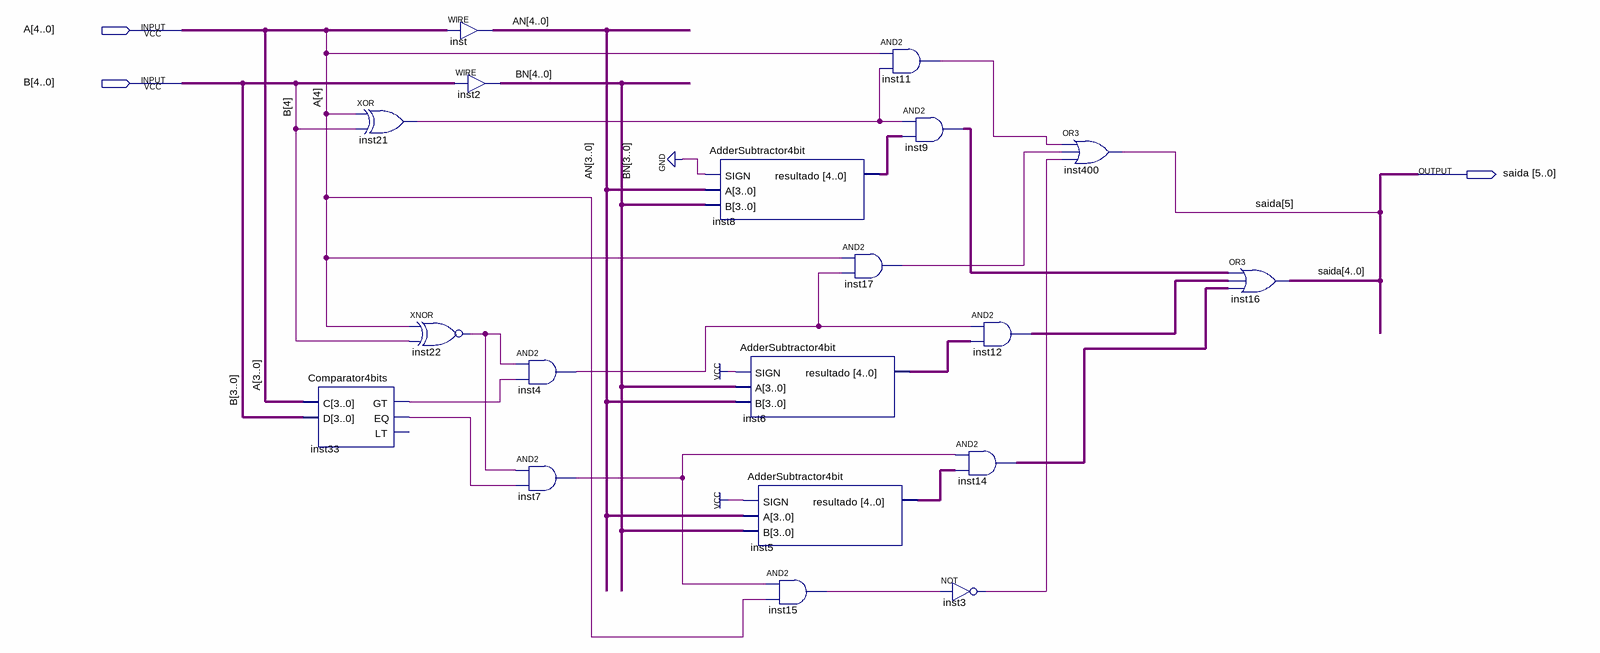
[diagram p0: schematic sheet]
// Quartus schematic SubOP.bdf as structural Verilog: 19 symbols, 3 pins
module SubOP (
  input  [4:0] A,
  input  [4:0] B,
  output [5:0] saida
);

  wire inst3_out, inst4_out, inst7_out, inst11_out, inst15_out, inst17_out, inst21_out, inst22_out,
       inst33_eq, inst33_gt;
  wire [4:0] AN, BN, inst5_resultado, inst6_resultado, inst8_resultado, inst9_out, inst12_out, inst14_out;

  Comparator4bits inst33 (.C(A[3:0]), .D(B[3:0]), .GT(inst33_gt), .EQ(inst33_eq));  // open: LT
  xor inst21 (inst21_out, A[4], B[4]);
  assign AN = A;  // WIRE inst
  assign BN = B;  // WIRE inst2
  xnor inst22 (inst22_out, A[4], B[4]);
  and inst4 (inst4_out, inst22_out, inst33_gt);
  and inst7 (inst7_out, inst22_out, inst33_eq);
  AdderSubtractor4bit inst8 (.SIGN(1'b0), .A(AN[3:0]), .B(BN[3:0]), .resultado(inst8_resultado));
  AdderSubtractor4bit inst6 (.SIGN(1'b1), .A(BN[3:0]), .B(AN[3:0]), .resultado(inst6_resultado));
  AdderSubtractor4bit inst5 (.SIGN(1'b1), .A(AN[3:0]), .B(BN[3:0]), .resultado(inst5_resultado));
  and inst15 (inst15_out, inst7_out, A[4]);
  and inst11 (inst11_out, A[4], inst21_out);
  and inst17 (inst17_out, A[4], inst4_out);
  assign inst9_out = {5{inst21_out}} & inst8_resultado;  // AND2 inst9, 5 bits wide
  not inst3 (inst3_out, inst15_out);
  assign inst12_out = {5{inst4_out}} & inst6_resultado;  // AND2 inst12, 5 bits wide
  assign inst14_out = {5{inst7_out}} & inst5_resultado;  // AND2 inst14, 5 bits wide
  or inst400 (saida[5], inst11_out, inst17_out, inst3_out);
  assign saida[4:0] = inst9_out | inst12_out | inst14_out;  // OR3 inst16, 5 bits wide
endmodule
